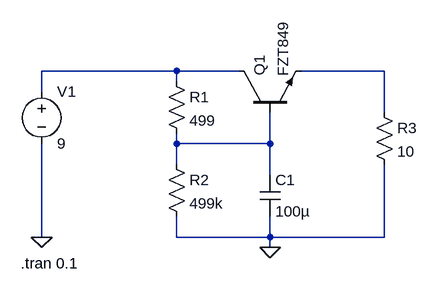
[diagram p0: schematic CapacMulti.asc]
CapacMulti.asc, the LTspice schematic file:
Version 4.1
SHEET 1 880 680
WIRE 112 96 -96 96
WIRE 208 96 112 96
WIRE 432 96 304 96
WIRE 112 112 112 96
WIRE -96 128 -96 96
WIRE 432 160 432 96
WIRE 112 208 112 192
WIRE 256 208 256 160
WIRE 256 208 112 208
WIRE 112 240 112 208
WIRE 256 256 256 208
WIRE -96 352 -96 208
WIRE 112 352 112 320
WIRE 256 352 256 320
WIRE 256 352 112 352
WIRE 432 352 432 240
WIRE 432 352 256 352
WIRE 256 368 256 352
FLAG 256 368 0
FLAG -96 352 0
SYMBOL npn 208 160 R270
SYMATTR InstName Q1
SYMATTR Value FZT849
SYMBOL cap 240 256 R0
SYMATTR InstName C1
SYMATTR Value 100µ
SYMBOL res 96 96 R0
SYMATTR InstName R1
SYMATTR Value 499
SYMBOL res 96 224 R0
SYMATTR InstName R2
SYMATTR Value 499k
SYMBOL voltage -96 112 R0
WINDOW 123 0 0 Left 0
WINDOW 39 0 0 Left 0
SYMATTR InstName V1
SYMATTR Value 9
SYMBOL res 416 144 R0
SYMATTR InstName R3
SYMATTR Value 10
TEXT -128 392 Left 2 !.tran 0.1

The netlist it stands for:
* CapacMulti.asc
Q1 N001 N003 N002 0 FZT849
C1 N003 0 100µ
R1 N001 N003 499
R2 N003 0 499k
V1 N001 0 9
R3 N002 0 10
.model NPN NPN
.model PNP PNP
.lib standard.bjt
.tran 0.1
.backanno
.end